# Altium schematic sheet PART6_Connectors.SchDoc: 连接件
size A3; Author: 崔 敖; 李尚文; Revision: B1.0; SheetNumber: 6; PageSetup: Record=PageOptions|CenterHorizontal=True|CenterVertical=True|PrintScale=1.00|XCorrection=1.00|YCorrection=1.00|PrintKind=0|BorderSize=5000000|LeftOffset=0|BottomOffset=0|Orientation=2|PaperLength=1000|PaperWidth=1000|Scale=100|PaperSource=7|PrintQuality=-4|MediaType=1|DitherType=10|PrintScaleMode=1|PaperKind=A4|PaperIndex=9
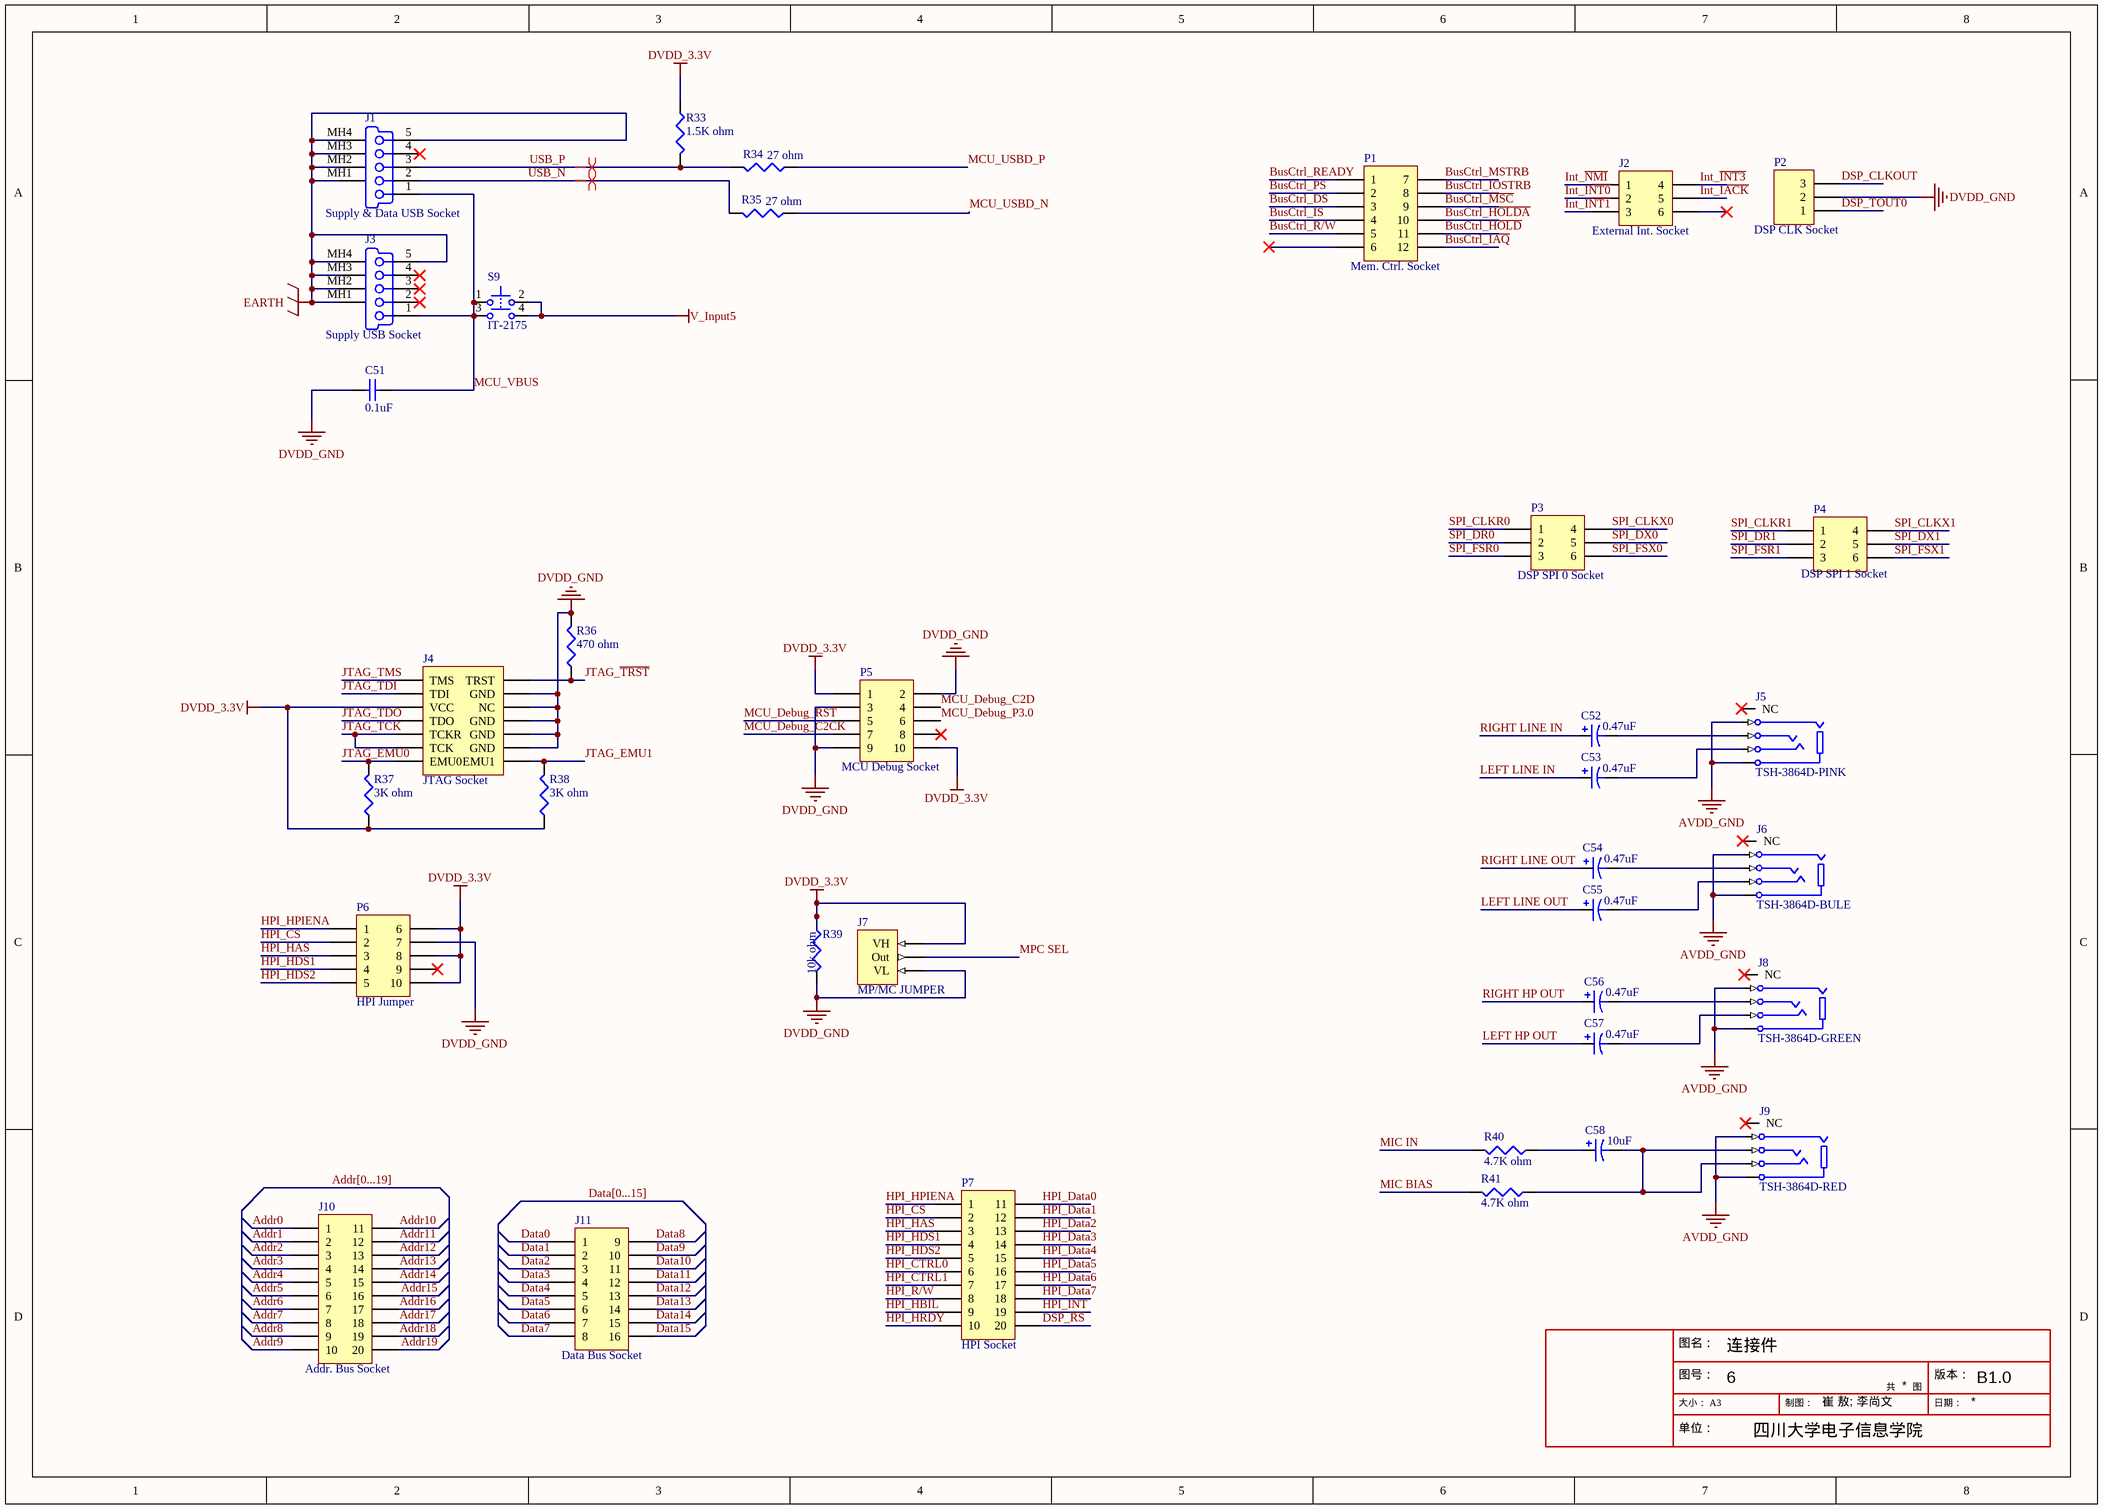
[diagram p0: PART6_Connectors.SchDoc]

## Parts
C51  value 0.1uF  [1608[0603]]  (hidden comment: Cap Semi)
C52  value 0.47uF  [C0805]  (hidden comment: Cap Tan)
C53  value 0.47uF  [C0805]  (hidden comment: Cap Tan)
C54  value 0.47uF  [C0805]  (hidden comment: Cap Tan)
C55  value 0.47uF  [C0805]  (hidden comment: Cap Tan)
C56  value 0.47uF  [C0805]  (hidden comment: Cap Tan)
C57  value 0.47uF  [C0805]  (hidden comment: Cap Tan)
C58  value 10uF  [C0805]  (hidden comment: Cap Tan)
J1  Supply & Data USB Socket  [481900001]
J2  External Int. Socket  [HDR2X3_CEN]
J3  Supply USB Socket  [481900001]
J4  JTAG Socket  [HDR2X7]
J5  TSH-3864D-PINK  [PJ-386D]
J6  TSH-3864D-BULE  [PJ-386D]
J7  MP/MC JUMPER  [HDR1X3]
J8  TSH-3864D-GREEN  [PJ-386D]
J9  TSH-3864D-RED  [PJ-386D]
J10  Addr. Bus Socket  [HDR2X10_CEN]
J11  Data Bus Socket  [HDR2X8_CEN]
P1  Mem. Ctrl. Socket  [HDR2X6_CEN]
P2  DSP CLK Socket  [HDR1X3]
P3  DSP SPI 0 Socket  [HDR2X3_CEN]
P4  DSP SPI 1 Socket  [HDR2X3_CEN]
P5  MCU Debug Socket  [HDR2X5]
P6  HPI Jumper  [HDR2X5_CEN]
P7  HPI Socket  [HDR2X10_CEN]
R33  value 1.5K ohm  [J1-0603]  (hidden comment: Res3)
R34  value 27 ohm  [J1-0603]  (hidden comment: Res3)
R35  value 27 ohm  [J1-0603]  (hidden comment: Res3)
R36  value 470 ohm  [J1-0603]  (hidden comment: Res3)
R37  value 3K ohm  [J1-0603]  (hidden comment: Res3)
R38  value 3K ohm  [J1-0603]  (hidden comment: Res3)
R39  value 10k ohm  [J1-0603]  (hidden comment: Res3)
R40  value 4.7K ohm  [J1-0603]  (hidden comment: Res3)
R41  value 4.7K ohm  [J1-0603]  (hidden comment: Res3)
S9  IT-2175  [IT-2175]

## Nets
AVDD_GND: J5.1(S) J5.4(SN) J6.1(S) J6.4(SN) J8.1(S) J8.4(SN) J9.1(S) J9.4(SN)
DVDD_3.3V: J4.5(VCC) J7.3(VH) P5.1 P5.10 P6.6 P6.8 P6.10 R33.1 R37.1 R38.1 R39.1
DVDD_GND: C51.1 J4.4(GND) J4.6(NC) J4.8(GND) J4.10(GND) J4.12(GND) J7.1(VL) P2.2 P5.2 P5.3 P5.9 P6.7 R36.2 R39.2
EARTH: J1.5(GND) J1.MH1(Tab) J1.MH2(Tab) J1.MH3(Tab) J1.MH4(Tab) J3.5(GND) J3.MH1(Tab) J3.MH2(Tab) J3.MH3(Tab) J3.MH4(Tab)
V_Input5: S9.2 S9.4
Addr0: J10.1
Addr1: J10.2
Addr2: J10.3
Addr3: J10.4
Addr4: J10.5
Addr5: J10.6
Addr6: J10.7
Addr7: J10.8
Addr8: J10.9
Addr9: J10.10
Addr10: J10.11
Addr11: J10.12
Addr12: J10.13
Addr13: J10.14
Addr14: J10.15
Addr15: J10.16
Addr16: J10.17
Addr17: J10.18
Addr18: J10.19
Addr19: J10.20
BusCtrl_~{DS}: P1.3
BusCtrl_~{HOLD}: P1.11
BusCtrl_~{HOLDA}: P1.10
BusCtrl_~{IAQ}: P1.12
BusCtrl_~{IS}: P1.4
BusCtrl_IOSTRB: P1.8
BusCtrl_~{MSC}: P1.9
BusCtrl_MSTRB: P1.7
BusCtrl_~{PS}: P1.2
BusCtrl_R/~{W}: P1.5
BusCtrl_READY: P1.1
Data0: J11.1
Data1: J11.2
Data2: J11.3
Data3: J11.4
Data4: J11.5
Data5: J11.6
Data6: J11.7
Data7: J11.8
Data8: J11.9
Data9: J11.10
Data10: J11.11
Data11: J11.12
Data12: J11.13
Data13: J11.14
Data14: J11.15
Data15: J11.16
DSP_CLKOUT: P2.3
DSP_~{RS}: P7.20
DSP_TOUT0: P2.1
HPI_~{CS}: P6.2 P7.2
HPI_CTRL0: P7.6
HPI_CTRL1: P7.7
HPI_Data0: P7.11
HPI_Data1: P7.12
HPI_Data2: P7.13
HPI_Data3: P7.14
HPI_Data4: P7.15
HPI_Data5: P7.16
HPI_Data6: P7.17
HPI_Data7: P7.18
HPI_~{HAS}: P6.3 P7.3
HPI_~{HDS1}: P6.4 P7.4
HPI_~{HDS2}: P6.5 P7.5
HPI_HBIL: P7.9
HPI_HPIENA: P6.1 P7.1
HPI_HRDY: P7.10
HPI_INT: P7.19
HPI_R/~{W}: P7.8
Int_~{IACK}: J2.5
Int_~{INT0}: J2.2
Int_~{INT1}: J2.3
Int_~{INT3}: J2.4
Int_~{NMI}: J2.1
JTAG_EMU0: J4.13(EMU0) R37.2
JTAG_EMU1: J4.14(EMU1) R38.2
JTAG_~{TRST}: J4.2(TRST) R36.1
JTAG_TCK: J4.9(TCKR) J4.11(TCK)
JTAG_TDI: J4.3(TDI)
JTAG_TDO: J4.7(TDO)
JTAG_TMS: J4.1(TMS)
LEFT HP OUT: C57.1
LEFT LINE IN: C53.1
LEFT LINE OUT: C55.1
MCU_Debug_C2CK: P5.7
MCU_Debug_C2D: P5.4
MCU_Debug_P3.0: P5.6
MCU_Debug_~{RST}: P5.5
MCU_USBD_N: R35.1
MCU_USBD_P: R34.1
MCU_VBUS: C51.2 J1.1(V_BUS_(5V)) J3.1(V_BUS_(5V)) S9.1 S9.3
MIC BIAS: R41.2
MIC IN: R40.2
MPC SEL: J7.2(Out)
RIGHT HP OUT: C56.1
RIGHT LINE IN: C52.1
RIGHT LINE OUT: C54.1
SPI_CLKR0: P3.1
SPI_CLKR1: P4.1
SPI_CLKX0: P3.4
SPI_CLKX1: P4.4
SPI_DR0: P3.2
SPI_DR1: P4.2
SPI_DX0: P3.5
SPI_DX1: P4.5
SPI_FSR0: P3.3
SPI_FSR1: P4.3
SPI_FSX0: P3.6
SPI_FSX1: P4.6
USB_N: J1.2(D-) R35.2
USB_P: J1.3(D+) R33.2 R34.2
NetC52_2: C52.2 J5.2(T)
NetC53_2: C53.2 J5.3(R)
NetC54_2: C54.2 J6.2(T)
NetC55_2: C55.2 J6.3(R)
NetC56_2: C56.2 J8.2(T)
NetC57_2: C57.2 J8.3(R)
NetC58_1: C58.1 R40.1
NetC58_2: C58.2 J9.2(T) J9.3(R) R41.1

Not connected (* = marked no-connect by the designer): J1 4(NC)*; J2 6*; J3 2(D-)* 3(D+)* 4(NC)*; J5 10(NC)*; J6 10(NC)*; J8 10(NC)*; J9 10(NC)*; P1 6*; P5 8*; P6 9*

## Buses and harness runs
bus Addr[0...19]
bus Data[0...15]

## Layout directives
differential pair: USB_N, USB_P

## Notes on the sheet
- 图名：
- 图号：
- 共
- 图
- 版本：
- 大小： A3
- 单位：
- 四川大学电子信息学院
- 制图：
- 日期：

## Library data of the parts
C51 = Cap Semi: 贴片电容 1608; Published: 8-Jun-2000; LatestRevisionDate: 29-May-2009; LatestRevisionNote: IPC-7351 Footprint Added.; PackageReference: C1206; Publisher: Altium Limited; PackageDescription: Chip Capacitor
C52-C58 = Cap Pol3: 贴片钽电容 C0805; Published: 8-Jun-2000; LatestRevisionDate: 29-May-2009; LatestRevisionNote: IPC-7351 Footprint Added.; PackageReference: C0805; Publisher: Altium Limited; PackageDescription: Chip Capacitor
J1 J3 = 0481900001: USB On-The-Go (OTG) Mini-B Receptacle, Right Angle, SMT, 0.80mm (.031") Pitch, Solder Tabs with Back Cover, Recessed Type; PCB_Layout: Complies with Manufacturer's Recommendation.; Published: 21-Sep-2007; DatasheetVersion: revA, May-2004; PackageVersion: May-2004; PackageReference: 481900001; Publisher: Altium Limited; PackageDescription: USB Mini-B, Sinking Type, SM; 5 Position; Right Angle, Body 11.45 x 11.8 x 3.9 mm (LxWxH); ComponentLink1Description: Manufacturer Link; ComponentLink1URL: http://www.molex.com/; ComponentLink2Description: Datasheet; ComponentLink2URL: http://www.molex.com/cmc_upload/0/000/895/958/SD-48190-001RevA.pdf
J2 P3 P4 = Header 3X2A: Header, 3-Pin, Dual row; LatestRevisionDate: 17-Jul-2002; LatestRevisionNote: Re-released for DXP Platform.; Publisher: Altium Limited
J4 = JTAG 14PIN CONN: Header, 7-Pin, Dual row; LatestRevisionDate: 17-Jul-2002; LatestRevisionNote: Re-released for DXP Platform.; Publisher: Altium Limited
J5 J6 J8 J9 = TSH-3864D: Phone Jack, PJ-386D Series, Right Angle, SM, 4-Conductor Open Circuit; PCB_Layout: Complies with manufacturer's recommendation.; DrillSize: Corresponds to nominal value.; Published: 30-May-2008; DatasheetVersion: revA, 2006; PackageVersion: revA, 2006; PackageReference: PJ-386D; Publisher: Altium Limited; PackageDescription: PJ-386D Series Phone Jack, Right Angle, SM, Body 14 x 6 x 4.8 mm (LxWxH); ComponentLink1Description: Manufacturer Link; ComponentLink1URL: http://www.contactswitch.com/; ComponentLink2Description: Datasheet; ComponentLink2URL: http://www.contactswitch.com/uploads/product/pdf_file_193.pdf
J7 P2 = Header 3: Header, 3-Pin; LatestRevisionDate: 17-Jul-2002; LatestRevisionNote: Re-released for DXP Platform.; Publisher: Altium Limited
J10 P7 = Header 10X2A: Header, 10-Pin, Dual row; LatestRevisionDate: 17-Jul-2002; LatestRevisionNote: Re-released for DXP Platform.; Publisher: Altium Limited
J11 = Header 8X2A: Header, 8-Pin, Dual row; LatestRevisionDate: 17-Jul-2002; LatestRevisionNote: Re-released for DXP Platform.; Publisher: Altium Limited
P1 = Header 6X2A: Header, 6-Pin, Dual row; LatestRevisionDate: 17-Jul-2002; LatestRevisionNote: Re-released for DXP Platform.; Publisher: Altium Limited
P5 = Header 5X2: Header, 5-Pin, Dual row; LatestRevisionDate: 17-Jul-2002; LatestRevisionNote: Re-released for DXP Platform.; Publisher: Altium Limited
P6 = Header 5X2A: Header, 5-Pin, Dual row; LatestRevisionDate: 17-Jul-2002; LatestRevisionNote: Re-released for DXP Platform.; Publisher: Altium Limited
R33-R41 = Res3: 贴片电阻 0603; Published: 8-Jun-2000; LatestRevisionDate: 29-May-2009; LatestRevisionNote: IPC-7351 Footprint Added.; PackageReference: J1-0603; Publisher: Altium Limited; PackageDescription: Chip Resistor
S9 = IT-2175: Tactile Switch, DPST; Thru-Hole; Vertical; Rating DC 12V, 50mA (max); PackageDocument: Rev.0; Published: 6-Jun-2005; DatasheetDocument: Rev.0; PackageReference: IT-2175; Publisher: Altium Limited; ComponentLink1Description: Manufacturer Link; ComponentLink1URL: http://www.ilswitch.com/; ComponentLink2Description: Device Overview; ComponentLink2URL: http://www.ilswitch.com/list.php?ac_id=010112&ai_id=91